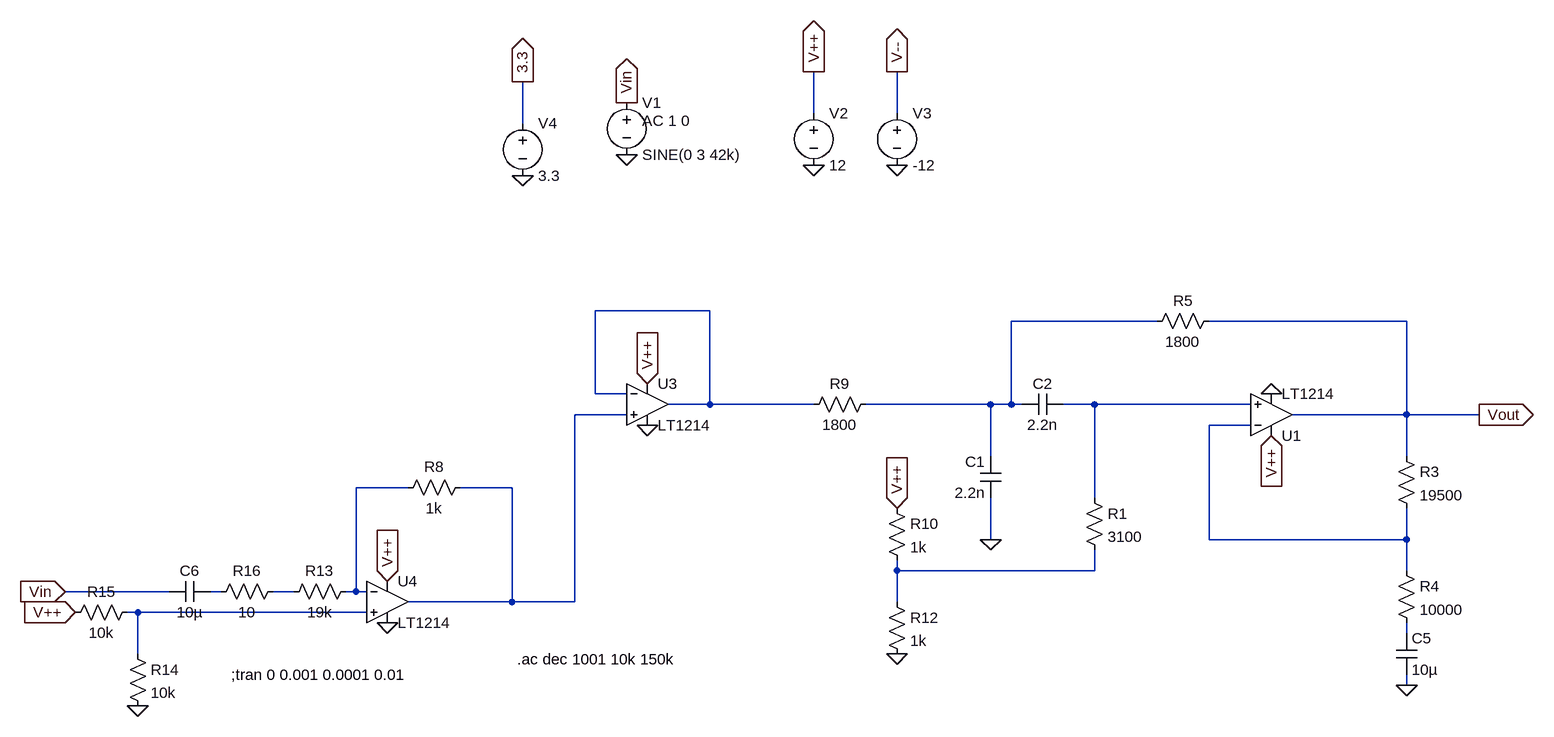
[diagram p0: schematic Transmitter_Circuit.asc]
Transmitter_Circuit.asc, the LTspice schematic file:
Version 4
SHEET 1 1120 680
WIRE -16 -320 -16 -384
WIRE 112 -320 112 -384
WIRE -464 -304 -464 -368
WIRE -176 -16 -352 -16
WIRE 512 0 288 0
WIRE 896 0 592 0
WIRE -352 112 -352 -16
WIRE -304 112 -352 112
WIRE -176 128 -176 -16
WIRE -176 128 -240 128
WIRE -16 128 -176 128
WIRE 256 128 64 128
WIRE 288 128 288 0
WIRE 288 128 256 128
WIRE 304 128 288 128
WIRE 416 128 368 128
WIRE 656 128 416 128
WIRE -304 144 -384 144
WIRE 896 144 896 0
WIRE 896 144 720 144
WIRE 1008 144 896 144
WIRE 656 160 592 160
WIRE 256 208 256 128
WIRE 896 208 896 144
WIRE -640 256 -720 256
WIRE -480 256 -560 256
WIRE 416 272 416 128
WIRE 256 336 256 272
WIRE 592 336 592 160
WIRE 896 336 896 288
WIRE 896 336 592 336
WIRE 112 384 112 368
WIRE 416 384 416 352
WIRE 416 384 112 384
WIRE 896 384 896 336
WIRE -1008 416 -1168 416
WIRE -928 416 -944 416
WIRE -816 416 -848 416
WIRE -720 416 -720 256
WIRE -720 416 -736 416
WIRE -704 416 -720 416
WIRE -480 432 -480 256
WIRE -480 432 -640 432
WIRE -384 432 -384 144
WIRE -384 432 -480 432
WIRE 112 432 112 384
WIRE -1056 448 -1072 448
WIRE -704 448 -1056 448
WIRE 896 480 896 464
WIRE -1056 512 -1056 448
WIRE 896 560 896 544
FLAG 256 336 0
FLAG -16 -240 0
FLAG 112 -240 0
FLAG 1008 144 Vout
IOPIN 1008 144 Out
FLAG -16 -384 V++
IOPIN -16 -384 Out
FLAG 112 -384 V--
IOPIN 112 -384 Out
FLAG -304 -256 0
FLAG -304 -336 Vin
IOPIN -304 -336 Out
FLAG -272 96 V++
IOPIN -272 96 In
FLAG -272 160 0
FLAG -464 -224 0
FLAG -464 -368 3.3
IOPIN -464 -368 Out
FLAG 688 176 V++
IOPIN 688 176 In
FLAG 896 560 0
FLAG 112 288 V++
IOPIN 112 288 In
FLAG 688 112 0
FLAG 112 512 0
FLAG -672 400 V++
IOPIN -672 400 In
FLAG -1168 416 Vin
IOPIN -1168 416 In
FLAG -1056 592 0
FLAG -672 464 0
FLAG -1152 448 V++
IOPIN -1152 448 In
SYMBOL cap 272 272 R180
WINDOW 0 24 56 Left 2
WINDOW 3 24 8 Left 2
SYMATTR InstName C1
SYMATTR Value 2.2n
SYMBOL cap 368 112 R90
WINDOW 0 0 32 VBottom 2
WINDOW 3 32 32 VTop 2
SYMATTR InstName C2
SYMATTR Value 2.2n
SYMBOL voltage -16 -336 R0
WINDOW 123 0 0 Left 0
WINDOW 39 0 0 Left 0
SYMATTR InstName V2
SYMATTR Value 12
SYMBOL voltage 112 -336 R0
WINDOW 123 0 0 Left 0
WINDOW 39 0 0 Left 0
SYMATTR InstName V3
SYMATTR Value -12
SYMBOL res 880 192 R0
SYMATTR InstName R3
SYMATTR Value 19500
SYMBOL res 880 368 R0
SYMATTR InstName R4
SYMATTR Value 10000
SYMBOL res 608 -16 R90
WINDOW 0 0 56 VBottom 2
WINDOW 3 32 56 VTop 2
SYMATTR InstName R5
SYMATTR Value 1800
SYMBOL voltage -304 -352 R0
WINDOW 123 24 44 Left 2
WINDOW 39 0 0 Left 0
SYMATTR Value2 AC 1 0
SYMATTR InstName V1
SYMATTR Value SINE(0 3 42k)
SYMBOL OpAmps\\LT1214 688 208 M180
SYMATTR InstName U1
SYMBOL res 80 112 R90
WINDOW 0 0 56 VBottom 2
WINDOW 3 32 56 VTop 2
SYMATTR InstName R9
SYMATTR Value 1800
SYMBOL Opamps\\LT1214 -272 64 R0
SYMATTR InstName U3
SYMBOL res 400 256 R0
SYMATTR InstName R1
SYMATTR Value 3100
SYMBOL voltage -464 -320 R0
WINDOW 123 0 0 Left 0
WINDOW 39 0 0 Left 0
SYMATTR InstName V4
SYMATTR Value 3.3
SYMBOL res 96 272 R0
SYMATTR InstName R10
SYMATTR Value 1k
SYMBOL cap 880 480 R0
SYMATTR InstName C5
SYMATTR Value 10µ
SYMBOL res 96 416 R0
SYMATTR InstName R12
SYMATTR Value 1k
SYMBOL Opamps\\LT1214 -672 368 R0
SYMATTR InstName U4
SYMBOL res -544 240 R90
WINDOW 0 0 56 VBottom 2
WINDOW 3 32 56 VTop 2
SYMATTR InstName R8
SYMATTR Value 1k
SYMBOL res -720 400 R90
WINDOW 0 0 56 VBottom 2
WINDOW 3 32 56 VTop 2
SYMATTR InstName R13
SYMATTR Value 19k
SYMBOL res -1072 496 R0
SYMATTR InstName R14
SYMATTR Value 10k
SYMBOL res -1056 432 R90
WINDOW 0 0 56 VBottom 2
WINDOW 3 32 56 VTop 2
SYMATTR InstName R15
SYMATTR Value 10k
SYMBOL cap -944 400 R90
WINDOW 0 0 32 VBottom 2
WINDOW 3 32 32 VTop 2
SYMATTR InstName C6
SYMATTR Value 10µ
SYMBOL res -832 400 R90
WINDOW 0 0 56 VBottom 2
WINDOW 3 32 56 VTop 2
SYMATTR InstName R16
SYMATTR Value 10
TEXT -472 520 Left 2 !.ac dec 1001 10k 150k
TEXT -912 544 Left 2 !;tran 0 0.001 0.0001 0.01

The netlist it stands for:
* Transmitter_Circuit.asc
C1 0 N002 2.2n
C2 N003 N002 2.2n
V2 V++ 0 12
V3 V-- 0 -12
R3 Vout N005 19500
R4 N005 N011 10000
R5 Vout N002 1800
V1 Vin 0 SINE(0 3 42k) AC 1 0
XU1 N003 N005 V++ 0 Vout LT1213  ; LT1214, pins In+ In- V+ V- OUT
R9 N002 N001 1800
XU3 N004 N001 V++ 0 N001 LT1213  ; LT1214, pins In+ In- V+ V- OUT
R1 N003 N007 3100
V4 3.3 0 3.3
R10 V++ N007 1k
C5 N011 0 10µ
R12 N007 0 1k
XU4 N010 N006 V++ 0 N004 LT1213  ; LT1214, pins In+ In- V+ V- OUT
R8 N004 N006 1k
R13 N006 N009 19k
R14 N010 0 10k
R15 N010 V++ 10k
C6 N008 Vin 10µ
R16 N009 N008 10
.ac dec 1001 10k 150k
;tran 0 0.001 0.0001 0.01
.lib LTC.lib
.backanno
.end